# Altium schematic sheet Safety_2019_V_3_0_TSAL.SchDoc
size A
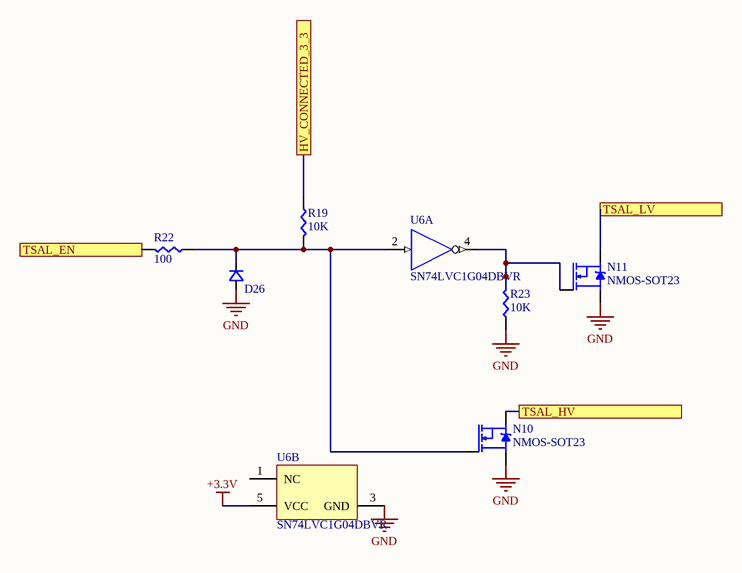
[diagram p0: Safety_2019_V_3_0_TSAL.SchDoc]

## Parts
D26  12V ZENER  [SOD123]  (value not drawn)
N10  NMOS-SOT23  [SOT23]
N11  NMOS-SOT23  [SOT23]
R19  10K  [RES-0603]
R22  100  [RES-0603]
R23  10K  [RES-0603]
U6  SN74LVC1G04DBVR  [DBV0005A_L]  (parts A,B of 2)

## Ports
HV_CONNECTED_3_3, TSAL_EN, TSAL_HV, TSAL_LV

## Nets
+3.3V: U6.5(VCC)
GND: D26.A N10.2(S) N11.2(S) R23.1 U6.3(GND)
HV_CONNECTED_3_3: R19.1 ; port HV_CONNECTED_3_3
TSAL_EN: R22.2 ; port TSAL_EN
TSAL_HV: N10.3(D) ; port TSAL_HV
TSAL_LV: N11.3(D) ; port TSAL_LV
NetD26_K: D26.K N10.1(G) R19.2 R22.1 U6.2(A)
NetN11_1: N11.1(G) R23.2 U6.4(Y)

Not connected (* = marked no-connect by the designer): U6 1(NC)

## Library data of the parts
D26 = DIODE-SOD123
R19 R22 R23 = RES-0603
U6 = CMP-0859-00134-2: Single Inverter, DBV0005A, LARGE T&R; Manufacturer: Texas Instruments; Rating: Catalog; ICC @ Nom Voltage(Max)(mA): 0.01; F @ Nom Voltage(Max)(Mhz): 150; Output Type: CMOS; VCC(Min)(V): 1.65; Technology Family: LVC; 3-State Output: No; tpd @ Nom Voltage(Max)(ns): 7.5,5.2,4.2,3.7; Sub-Family: Inverting Buffer/Driver; Voltage(Nom)(V): 1.8,2.5,3.3,5; Output Drive (IOL/IOH)(Max)(mA): 32/-32; Bits(#): 1; VCC(Max)(V): 5.5; Logic: Inverting; Input Type: CMOS/TTL; PackageReference: DBV0005A; ComponentLink2URL: http://www.ti.com/lit/ds/symlink/sn74lvc1g04.pdf; Schmitt Trigger: No; DatasheetVersion: SCES214AD; Operating Temperature Range(C): -40 to 125,-40 to 85; ComponentLink1URL: http://www.ti.com/; ComponentLink2Description: Datasheet; ComponentLink1Description: Manufacturer URL; PartNumber: SN74LVC1G04DBVR; Generic Part Number: SN74LVC1G04; PartId: 1